# Altium project Clase4_RS232.PrjPcb
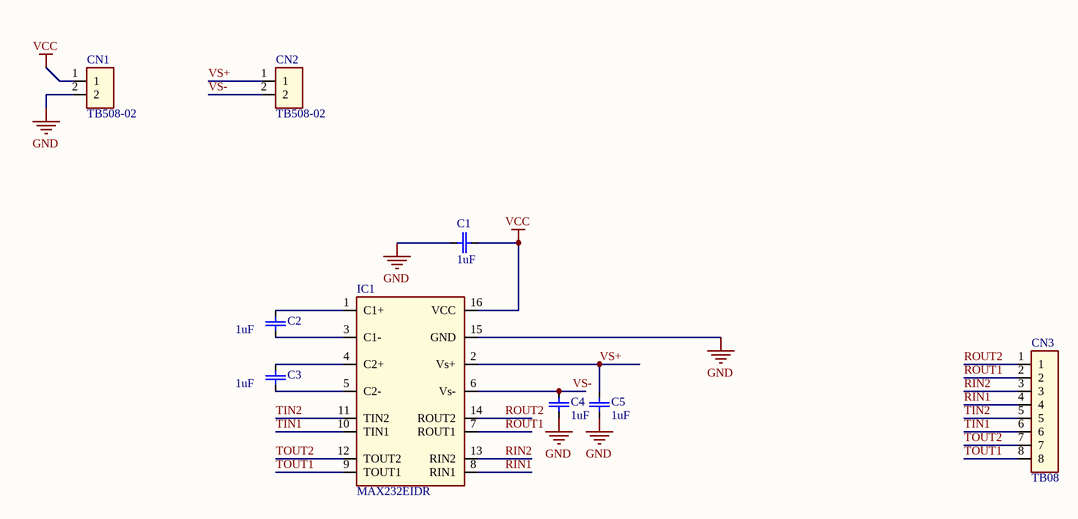
[diagram p0: Sheet1.SchDoc]
1 sheet, 9 parts. Net scope: global (net labels, ports and power ports of the same name join across sheets).
Board file: PCB1.PcbDoc

## Sheet Sheet1.SchDoc
size A4; SheetNumber: 1; SheetTotal: 1

### Parts
C1  1uF  [C1206]
C2  1uF  [C0805]
C3  1uF  [C0805]
C4  1uF  [C1206]
C5  1uF  [C1206]
CN1  TB508-02  [TB508-02]
CN2  TB508-02  [TB508-02]
CN3  TB08  [TB508-08]
IC1  MAX232EIDR  [SOIC16-N]

### Nets
GND: C1.2 C4.1 C5.1 CN1.2 IC1.15(GND)
VCC: C1.1 CN1.1 IC1.16(VCC)
RIN1: CN3.4 IC1.8(RIN1)
RIN2: CN3.3 IC1.13(RIN2)
ROUT1: CN3.2 IC1.7(ROUT1)
ROUT2: CN3.1 IC1.14(ROUT2)
TIN1: CN3.6 IC1.10(TIN1)
TIN2: CN3.5 IC1.11(TIN2)
TOUT1: CN3.8 IC1.9(TOUT1)
TOUT2: CN3.7 IC1.12(TOUT2)
VS+: C5.2 CN2.1 IC1.2(Vs+)
VS-: C4.2 CN2.2 IC1.6(Vs-)
NetC2_1: C2.1 IC1.1(C1+)
NetC2_2: C2.2 IC1.3(C1-)
NetC3_1: C3.1 IC1.4(C2+)
NetC3_2: C3.2 IC1.5(C2-)

### Library data of the parts
C1-C5 = Capacitor: Capacitor without polarity; Value: 100nF; Voltage: 25V; Part number: *; Manufacturer: *; Unit price: *
CN1 CN2 = TB-02: Terminal Block; Manufacturer: *; Part number: *; Unit price: *; Value: TB508-02
CN3 = TB-08: Terminal Block; Manufacturer: *; Part number: *; Value: TB08; Unit price: *
IC1 = MAX232: 2/2 Transceiver Full RS232 16-SOIC; Manufacturer: *; Unit price: *; Value: MAX232EIDR; Part number: *